# Altium schematic sheet DAC_ASCII.SchDoc: Analog outputs
size A3; DrawnBy: Daniel Berard; Engineer: Daniel Berard; DocumentNumber: 2; Revision: 1; SheetNumber: 2; SheetTotal: 4; ProjectName: STM
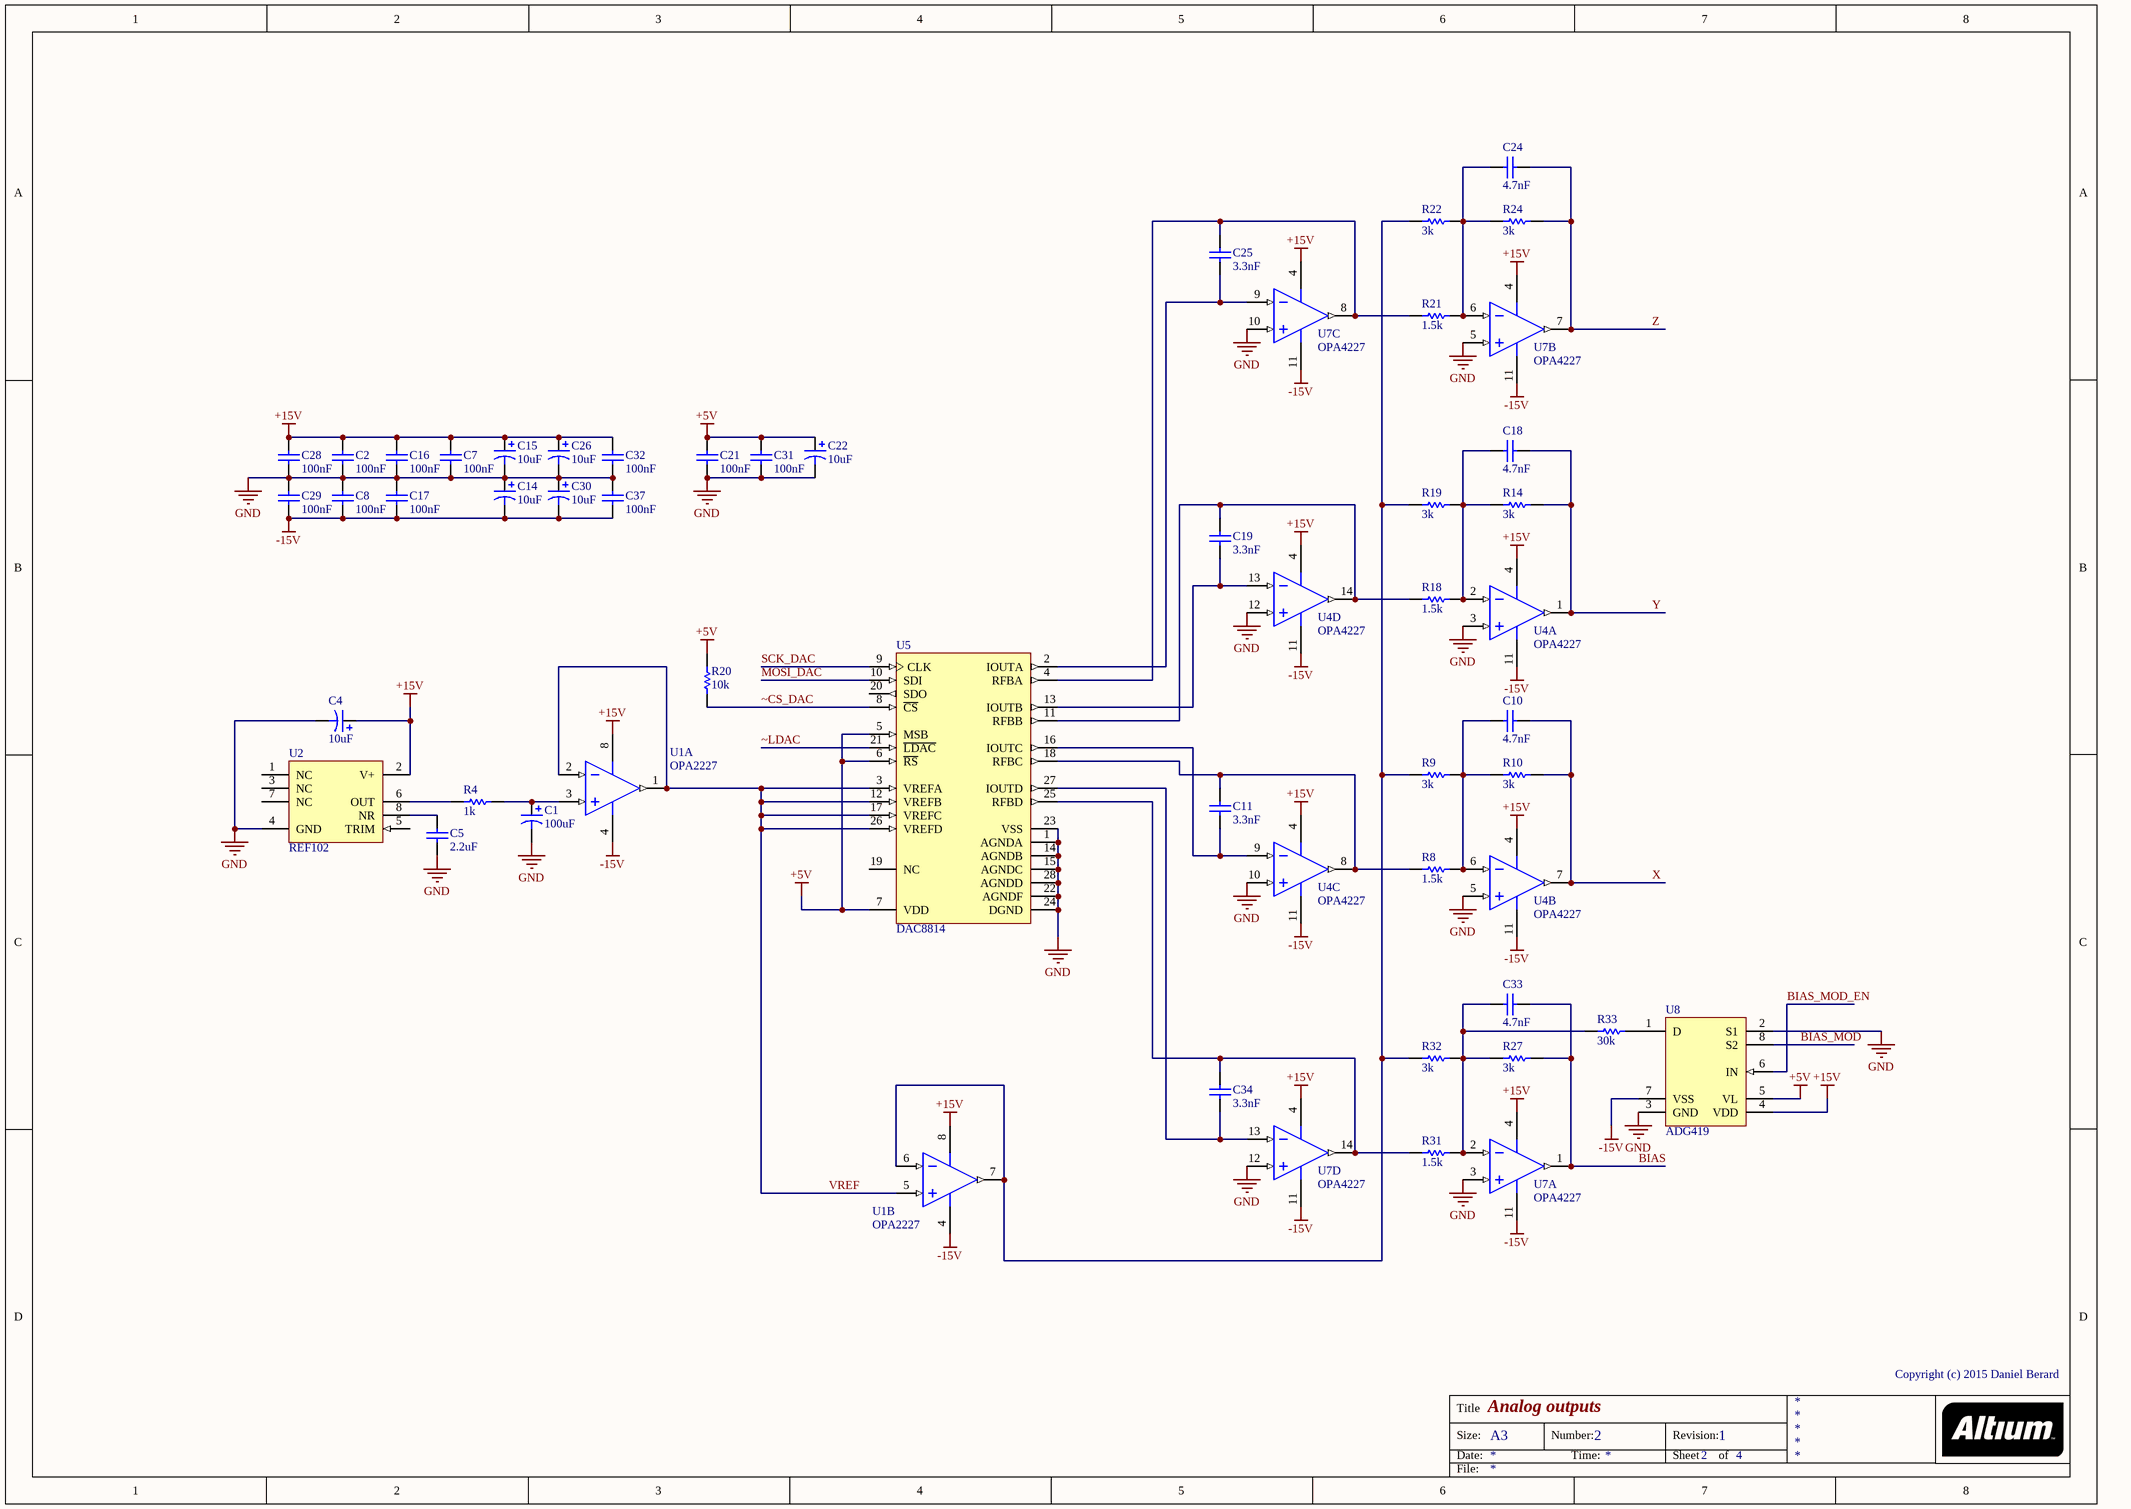
[diagram p0: DAC_ASCII.SchDoc]

## Parts
C1  100uF  [7343]
C2  100nF  [6-0805_N]
C4  10uF  [3528]
C5  2.2uF  [C1206]
C7  100nF  [6-0805_N]
C8  100nF  [6-0805_N]
C10  4.7nF  [6-0805_N]
C11  3.3nF  [6-0805_N]
C14  10uF  [3528]
C15  10uF  [3528]
C16  100nF  [6-0805_N]
C17  100nF  [6-0805_N]
C18  4.7nF  [6-0805_N]
C19  3.3nF  [6-0805_N]
C21  100nF  [6-0805_N]
C22  10uF  [6-0805_N]
C24  4.7nF  [6-0805_N]
C25  3.3nF  [6-0805_N]
C26  10uF  [3528]
C28  100nF  [6-0805_N]
C29  100nF  [6-0805_N]
C30  10uF  [3528]
C31  100nF  [6-0805_N]
C32  100nF  [6-0805_N]
C33  4.7nF  [6-0805_N]
C34  3.3nF  [6-0805_N]
C37  100nF  [6-0805_N]
R4  1k  [6-0805_N]
R8  1.5k  [6-0805_N]
R9  3k  [6-0805_N]
R10  3k  [6-0805_N]
R14  3k  [6-0805_N]
R18  1.5k  [6-0805_N]
R19  3k  [6-0805_N]
R20  10k  [6-0805_N]
R21  1.5k  [6-0805_N]
R22  3k  [6-0805_N]
R24  3k  [6-0805_N]
R27  3k  [6-0805_N]
R31  1.5k  [6-0805_N]
R32  3k  [6-0805_N]
R33  30k  [6-0805_N]
U1  OPA2227  [ADI-R-8_M]  (parts A,B of 2)
U2  REF102  [182H_N]
U4  OPA4227  [TI-D14_M]  (parts A,B,C,D of 4)
U5  DAC8814  [TI-DB28_L]
U7  OPA4227  [TI-D14_M]  (parts A,B,C,D of 4)
U8  ADG419  [ADI-RM-8_N]

## Nets
+5V: C21.2 C22.1 C31.2 R20.2 U5.5(MSB) U5.6(~{RS}) U5.7(VDD) U8.5(VL)
+15V: C2.2 C4.1 C7.1 C15.1 C16.2 C26.1 C28.2 C32.2 U1.8(+V) U2.2(V+) U4.4(V+) U7.4(V+) U8.4(VDD)
-15V: C8.1 C14.2 C17.1 C29.1 C30.2 C37.1 U1.4(-V) U4.11(V-) U7.11(V-) U8.7(VSS)
GND: C1.2 C2.1 C4.2 C5.2 C7.2 C8.2 C14.1 C15.2 C16.1 C17.2 C21.1 C22.2 C26.2 C28.1 C29.2 C30.1 C31.1 C32.1 C37.2 U2.4(GND) U4.3(IN_A+) U4.5(IN_B+) U4.10(IN_C+) U4.12(IN_D+) U5.1(AGNDA) U5.14(AGNDB) U5.15(AGNDC) U5.22(AGNDF) U5.23(VSS) U5.24(DGND) U5.28(AGNDD) U7.3(IN_A+) U7.5(IN_B+) U7.10(IN_C+) U7.12(IN_D+) U8.2(S1) U8.3(GND)
BIAS: C33.2 R27.2 U7.1(OUT_A)
BIAS_MOD: U8.8(S2)
BIAS_MOD_EN: U8.6(IN)
MOSI_DAC: U5.10(SDI)
SCK_DAC: U5.9(CLK)
VREF: U1.1(OUT_A) U1.2(-IN_A) U1.5(+IN_B) U5.3(VREFA) U5.12(VREFB) U5.17(VREFC) U5.26(VREFD)
X: C10.2 R10.2 U4.7(OUT_B)
Y: C18.2 R14.2 U4.1(OUT_A)
Z: C24.2 R24.2 U7.7(OUT_B)
~CS_DAC: R20.1 U5.8(~{CS})
~LDAC: U5.21(~{LDAC})
NetC1_1: C1.1 R4.2 U1.3(+IN_A)
NetC5_1: C5.1 U2.8(NR)
NetC10_1: C10.1 R8.2 R9.2 R10.1 U4.6(IN_B-)
NetC11_1: C11.1 U4.9(IN_C-) U5.16(IOUTC)
NetC11_2: C11.2 R8.1 U4.8(OUT_C) U5.18(RFBC)
NetC18_1: C18.1 R14.1 R18.2 R19.2 U4.2(IN_A-)
NetC19_1: C19.1 U4.13(IN_D-) U5.13(IOUTB)
NetC19_2: C19.2 R18.1 U4.14(OUT_D) U5.11(RFBB)
NetC24_1: C24.1 R21.2 R22.2 R24.1 U7.6(IN_B-)
NetC25_1: C25.1 U5.2(IOUTA) U7.9(IN_C-)
NetC25_2: C25.2 R21.1 U5.4(RFBA) U7.8(OUT_C)
NetC33_1: C33.1 R27.1 R31.2 R32.2 R33.1 U7.2(IN_A-)
NetC34_1: C34.1 U5.27(IOUTD) U7.13(IN_D-)
NetC34_2: C34.2 R31.1 U5.25(RFBD) U7.14(OUT_D)
NetR4_1: R4.1 U2.6(OUT)
NetR9_1: R9.1 R19.1 R22.1 R32.1 U1.6(-IN_B) U1.7(OUT_B)
NetR33_2: R33.2 U8.1(D)

Not connected (* = marked no-connect by the designer): U2 1(NC) 3(NC) 5(TRIM) 7(NC); U5 19(NC) 20(SDO)

## Notes on the sheet
- Copyright (c) 2015 Daniel Berard
- Title
- Size:
- Date:
- A3
- Number:
- Time:
- Revision:
- Sheet
- of
- File:

## Library data of the parts
C1 C4 C14 C15 C22 C26 C30 = Cap Pol1: Polarized Capacitor (Radial); Value: 100pF; Published: 8-Jun-2000; LatestRevisionDate: 17-Jul-2002; LatestRevisionNote: Re-released for DXP Platform.; PackageReference: RB7.6-15; Publisher: Altium Limited; PackageDescription: Polarized Capacitor (Radial); 2 Leads
C2 C5 C7 C8 C10 C11 C16-C19 C21 C24 C25 C28 C29 C31-C34 C37 = Cap: Capacitor; Value: 100pF; Published: 8-Jun-2000; LatestRevisionDate: 17-Jul-2002; LatestRevisionNote: Re-released for DXP Platform.; PackageReference: RAD-0.3; Publisher: Altium Limited; PackageDescription: Radial Cap, Thru-Hole; 2 Leads; 0.3 in Pin Spacing
R4 = Res1: Resistor; Published: 8-Jun-2000; LatestRevisionDate: 17-Jul-2002; LatestRevisionNote: Re-released for DXP Platform.; PackageReference: AXIAL-0.3; Publisher: Altium Limited; PackageDescription: Axial Device, Thru-Hole; 2 Leads; 0.3 in Pin Spacing; Value: 1K
R8-R10 R14 R18-R22 R24 R27 R31-R33 = Res1: Resistor; Value: 1K; Published: 8-Jun-2000; LatestRevisionDate: 17-Jul-2002; LatestRevisionNote: Re-released for DXP Platform.; PackageReference: AXIAL-0.3; Publisher: Altium Limited; PackageDescription: Axial Device, Thru-Hole; 2 Leads; 0.3 in Pin Spacing
U1 = CMP-0384-01147-2: Double Channel Wide Bandwidth Operational Amplifier, 10 MHz BW, 2.5 V/us SR, Industrial, 8-pin SOIC (R-8), Tube; Manufacturer: Analog Devices; Generic Part Number: AD8676; PartNumber: AD8676BRZ; V Span Min: 10V; Input Offset Voltage: 12uV; V Span Max: 36V; Iq/Amp: 2.7mA; Input Bias Current: 2.4nA; Small Signal Bandwidth: 10MHz; Amplifiers Per Package: 2; ComponentLink2Description: Datasheet; RevisionNote: Reference Circuit URL fixed; ComponentLink4URL: http://www.analog.com/en/all-operational-amplifiers-op-amps/operational-amplifiers-op-amps/ad8676/products/product.html#product-recommendations; Code_JEDEC: MS-012-AA; PackageDescription: 8-Pin Standard Small Outline Package, Body 3.9 x 4.9 mm, Pitch 1.27 mm; Mounting Technology: Surface Mount; Slew Rate: 2.5V/us; ComponentLink4Description: Reference Circuit; PackageVersion: 060506-A; ComponentLink1URL: http://www.analog.com/en/index.html; ComponentLink2URL: http://www.analog.com/static/imported-files/data_sheets/AD8676.pdf; ComponentLink1Description: Manufacturer URL; ComponentLink3Description: Package Specification; DatasheetVersion: Rev. C; ComponentLink3URL: http://www.analog.com/static/imported-files/packages/PKG_PDF/SOIC_Narrow%20(R)/R_8.pdf; PackageReference: R-8
U2 = REF102AU: Precision Voltage Reference; Note: Pins 1,3 and 7 are No internal Connection (NC) pins.; Published: 8-Jun-2000; LatestRevisionDate: 13-Apr-2006; LatestRevisionNote: IPC-7351 Footprint Added.; DatasheetVersion: Oct-1993; PackageReference: 182H; Publisher: Altium Limited; PackageDescription: 8-Pin Small Outline Integrated Circuit 1.27 mm Pitch; Code_JEDEC: MS-012-AA; Code_IPC: SOIC127P600-8; ComponentLink1Description: Manufacturer Link; ComponentLink1URL: http://www.ti.com/; ComponentLink2Description: Datasheet; ComponentLink2URL: http://www-s.ti.com/sc/ds/REF102.pdf
U4 U7 = CMP-0272-00152-2: High Precision, Low Noise Operational Amplifier, 5 to 36 V, -40 to 85 degC, 14-pin SOIC (D14), Green (RoHS & no Sb/Br); PartNumber: OPA4227UA/2K5; Manufacturer: Texas Instruments; Offset Drift(Typ)(uV/C): 0.3; Total Supply Voltage(Max)(+5V is 5, +/-5V is 10): 36; Vio (25C)(Max)(mV): 0.2; CMRR(Min)(dB): 120; Iq per channel(Max)(mA): 3.8; GBW(Typ)(MHz): 8; Number of Channels: 4; Rating: Catalog; IIB(Max)(pA): 10000; Slew Rate(Typ)(V/us): 2.3; Total Supply Voltage(Min)(+5V is 5, +/-5V is 10): 5; Packing: LARGE T&R; Sub Family: High Supply Voltage Amplifier (>=30V), Low Noise Amp (<=10nV/rtHz), Low Offset Voltage Amplifier (<=500uV), Precision Amplifier; PackageReference: D14; ComponentLink2Description: Datasheet; ComponentLink3URL: http://www.ti.com/lit/ml/mpds177g/mpds177g.pdf; Code_JEDEC: MS-012; DatasheetVersion: SBOS110A; Eco-Plan: Green (RoHS & no Sb/Br); ComponentLink3Description: Package Specification; ComponentLink2URL: http://www.ti.com/lit/ds/symlink/opa4227.pdf; ComponentLink1URL: http://www.ti.com/; Mounting Technology: Surface Mount; PackageDescription: 14-Pin Plastic Small Outline, Body 8.65 x 3.9 mm, Pitch 1.27 mm; PackageVersion: 4040047-5/M, 06/2011; ComponentLink1Description: Manufacturer URL
U5 = CMP-0004-00286-1: 16-Bit, Quad, Serial Input Multiplying Digital to Analog Converter, -40 to 85 degC, 28-pin SOP (DB28), Green (RoHS & no Sb/Br); Manufacturer: Texas Instruments; PartNumber: DAC8814ICDBTG4; Resolution(Bits): 16; DAC Channels: 4; SubFamily: Precision DAC (=<10MSPS); INL(Max)(+/-LSB): 1; Settling Time(us): 0.5; Interface: Serial SPI; Eco-Plan: Green (RoHS & no Sb/Br); PackageReference: DB28; ComponentLink1URL: http://www.ti.com/; DatasheetVersion: SBAS338D; PackageDescription: 28-Pin Plastic Small Outline, Body 10.2 X 5.3 mm, Pitch 0.65 mm; ComponentLink3Description: Package Specification; ComponentLink3URL: http://www.ti.com/lit/ml/msso002e/msso002e.pdf; ComponentLink2Description: Datasheet; Code_JEDEC: MO-150; ComponentLink2URL: http://www.ti.com/general/docs/lit/getliterature.tsp?genericPartNumber=DAC8814&fileType=pdf; ComponentLink1Description: Manufacturer URL; PackageVersion: 4040065/E, 12/2001; Mounting Technology: Surface Mount; DNL(Max)(+/-LSB): 1
U8 = CMP-0792-00196-1: LC2MOS Precision Mini-DIP Analog Switches, 25 Ohm Ron, 8-pin SOP (RM-8), Tube; Manufacturer: Analog Devices; PartNumber: ADG419BRMZ; Ron (ohms): 25, 40; Configuration: SPDT; Max Pos Supply: +16.5V; # Sw Functions: 1; Max Neg Supply: -16.5V; ComponentLink2Description: Datasheet; DatasheetVersion: Rev. C; Code_JEDEC: MO-187-AA; PackageVersion: Aug-05; ComponentLink1Description: Manufacturer URL; Mounting Technology: Surface Mount; ComponentLink3URL: http://www.analog.com/static/imported-files/packages/PKG_PDF/MSOP%28RM%29/RM_8.pdf; Packing: Tube; ComponentLink1URL: http://www.analog.com/en/index.html; ComponentLink3Description: Package Specification; PackageDescription: 8-Pin Mini Small Outline Package, Body 3 x 3 mm, Pitch 0.65 mm; PackageReference: RM-8; ComponentLink2URL: http://www.analog.com/static/imported-files/data_sheets/ADG419.pdf